# EAGLE design WiFi_MBUS_Reader (EAGLE 6.6.0)
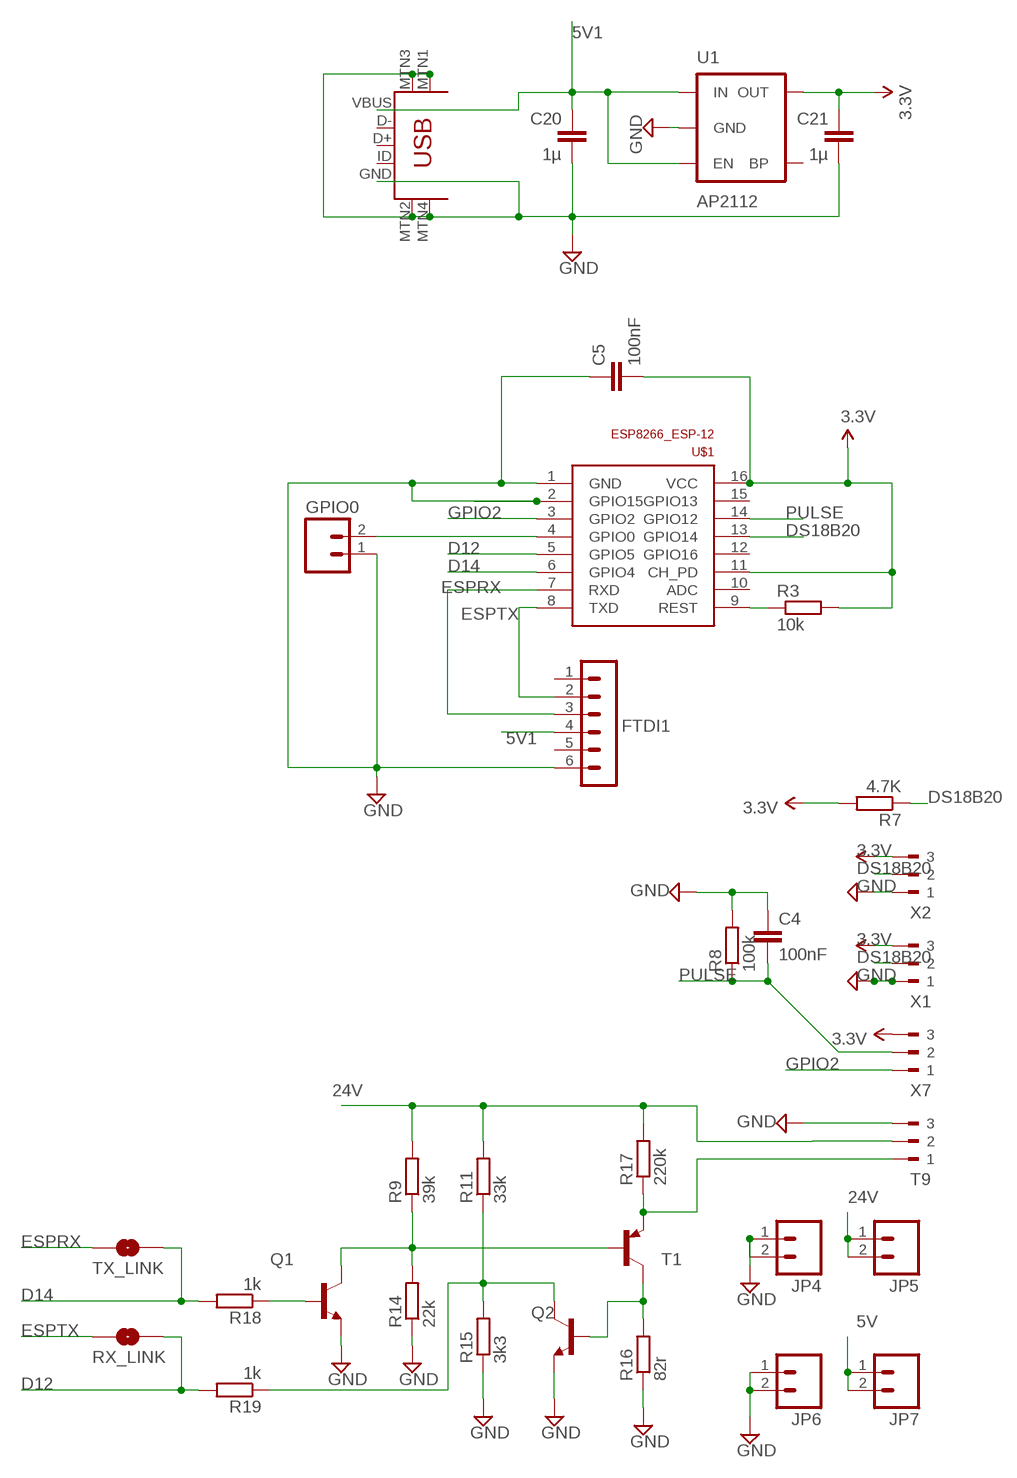
[diagram p0: schematic, sheet 1]

## Parts
C4  100nF  C-EUC0603  [C0603]
C5  100nF  C-EUC0603  [C0603]
C20  1µ  C-EUC0603  [C0603]
C21  1µ  C-EUC0603  [C0603]
FTDI1  FTDI  MA06-1  [MA06-1]
GPIO0  M02PTH  [1X02]
JP4  M02PTH  [1X02]
JP5  M02PTH  [1X02]
JP6  M02PTH  [1X02]
JP7  M02PTH  [1X02]
Q1  BC808-NPN-SOT23-BEC  [SOT23-BEC]
Q2  BC808-NPN-SOT23-BEC  [SOT23-BEC]
R3  10k  R-EU_R0603  [R0603]
R7  4.7K  R-EU_R0603  [R0603]
R8  100k  R-EU_R0603  [R0603]
R9  39k  R-EU_R0603  [R0603]
R11  33k  R-EU_R0603  [R0603]
R14  22k  R-EU_R0603  [R0603]
R15  3k3  R-EU_R0603  [R0603]
R16  82r  R-EU_R0603  [R0603]
R17  220k  R-EU_R0603  [R0603]
R18  1k  R-EU_R0603  [R0603]
R19  1k  R-EU_R0603  [R0603]
RX_LINK  SOLDERJUMPERNO  [SJ_2S-NO]
T1  BC807-16-PNP-SOT23-BEC  [SOT23-BEC]
T9  180-3  [180-3]
TX_LINK  SOLDERJUMPERNO  [SJ_2S-NO]
U1  AP2112  V_REG_LDOSMD  [SOT23-5]
U$1  ESP8266_ESP-12  [ESP8266-ESP12]
U$10  USB-MINIB-5PIN  [USB-MINIB-CISECO]
X1  180-3  [180-3]
X2  180-3  [180-3]
X7  180-3  [180-3]

## Nets
3.3V: C5.2 C21.1 R3.2 R7.2 U1.5(OUT) U$1.11(CH_PD) U$1.16(VCC) X1.3 X2.3 X7.3
5V [power]: JP7.1 JP7.2
5V1 [power]: C20.1 FTDI1.4 U1.1(IN) U1.3(EN) U$10.VBUS
24V: JP5.1 JP5.2 R9.2 R11.2 R17.2 T9.2
D12: R19.2 RX_LINK.2 U$1.5(GPIO5)
D14: R18.2 TX_LINK.2 U$1.6(GPIO4)
DS18B20: R7.1 U$1.13(GPIO14) X1.2 X2.2
ESPRX: FTDI1.3 TX_LINK.1 U$1.7(RXD)
ESPTX: FTDI1.2 RX_LINK.1 U$1.8(TXD)
GND [power]: C4.1 C5.1 C20.2 C21.2 FTDI1.6 GPIO0.1 JP4.1 JP4.2 JP6.1 JP6.2 Q1.E Q2.E R8.2 R14.1 R15.1 R16.1 T9.3 U1.2(GND) U$1.1(GND) U$1.2(GPIO15) U$10.GND U$10.MTN1(MTN2) U$10.MTN2(MTN3) U$10.MTN3(MTN1) U$10.MTN4 X1.1 X2.1
GPIO2: U$1.3(GPIO2) X7.1
N$13: R17.1 T1.E T9.1
N$16: Q2.B R16.2 T1.C
N$18: Q1.C R9.1 R14.2 T1.B
N$21: Q2.C R11.1 R15.2 R19.1
N$25: Q1.B R18.1
N$29: GPIO0.2 U$1.4(GPIO0)
N$40: R3.1 U$1.9(REST)
PULSE: C4.2 R8.1 U$1.14(GPIO12) X7.2
Unconnected: FTDI1.1 FTDI1.5 U1.4(BP) U$1.10(ADC) U$1.12(GPIO16) U$1.15(GPIO13) U$10.D+ U$10.D- U$10.ID

## Library data of the parts
C4 C5 C20 C21 = resistor:C-EU: CAPACITOR, European symbol
FTDI1 = JeeLabs:MA06-1: PIN HEADER
GPIO0 JP4-JP7 = SparkFun:M02: Header 2 Standard 2-pin 0.1" header. Use with straight break away headers (SKU : PRT-00116), right angle break away headers (PRT-00553), swiss pins (PRT-00743), machine pins (PRT-00117), and female headers (PRT-00115). Molex polarized connector foot print use with SKU : PRT-08233 with associated crimp pins and housings.
Q1 Q2 = transistor:*-NPN-: NPN Transistror BF959 corrected 2008.03.06
R3 R7-R9 R11 R14-R19 = rcl:R-EU_: RESISTOR, European symbol
RX_LINK TX_LINK = SparkFun:SOLDERJUMPER: Solder Jumper Standard SMD solder jumper. Used to automate production. Two varients : Normally Open and Normally Closed are the same, but have different paste layers. NC will have a large amount of paste and should jumper during reflow.
T1 = transistor:*-PNP-: PNP Transistror
T9 X1 X2 X7 = con-weidmueller-sl35:180-3: WEIDMUELLER CLAMP CONNECTOR; OC_FARNELL: unknown; OC_NEWARK: unknown
U1 = SparkFun:V_REG_LDO: Voltage Regulator LDO Standard 150mA LDO voltage regulator in SOT-23 layout. Micrel part MIC5205. BP (by-pass) pin is used to lower output noise with 470pF cap.
U$1 = ESP8266-ESP12:ESP8266_ESP-12
U$10 = Ciseco USB miniB_Updated:USB-MINIB: Mini-USB "B" connector with 5th pin broken out. Created new symbol breaking out 5th "ID" pin in mini/micro USB connector spec. See: http://en.wikipedia.org/wiki/Mini_usb#Cables. Uses same footprint as 4-pin symbol. Also added pins to connect to mounting / shield pads if required (probably not generally needed as signals aren't shielded once they leave the connector). Modified by Ciseco for Rapid Part 24-0357

## Net classes
0 default: width 0.203 mm, drill 0.6 mm, clearance 0.203 mm
1 power: width 0.381 mm, drill 0.6 mm, clearance 0.254 mm
2 gnd: width 0.254 mm, drill 0.6 mm, clearance 0.254 mm

## Board
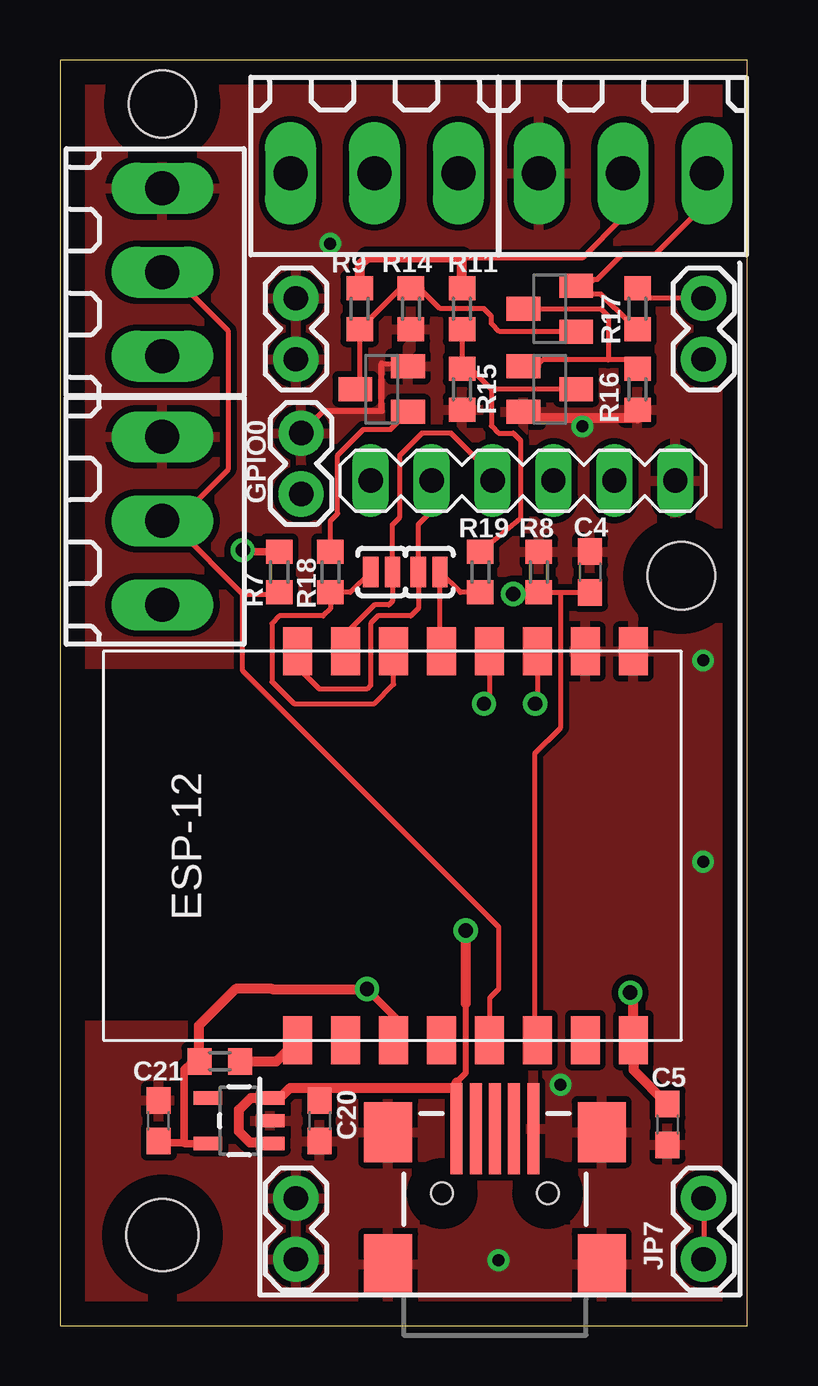
[diagram p1: board, top side]
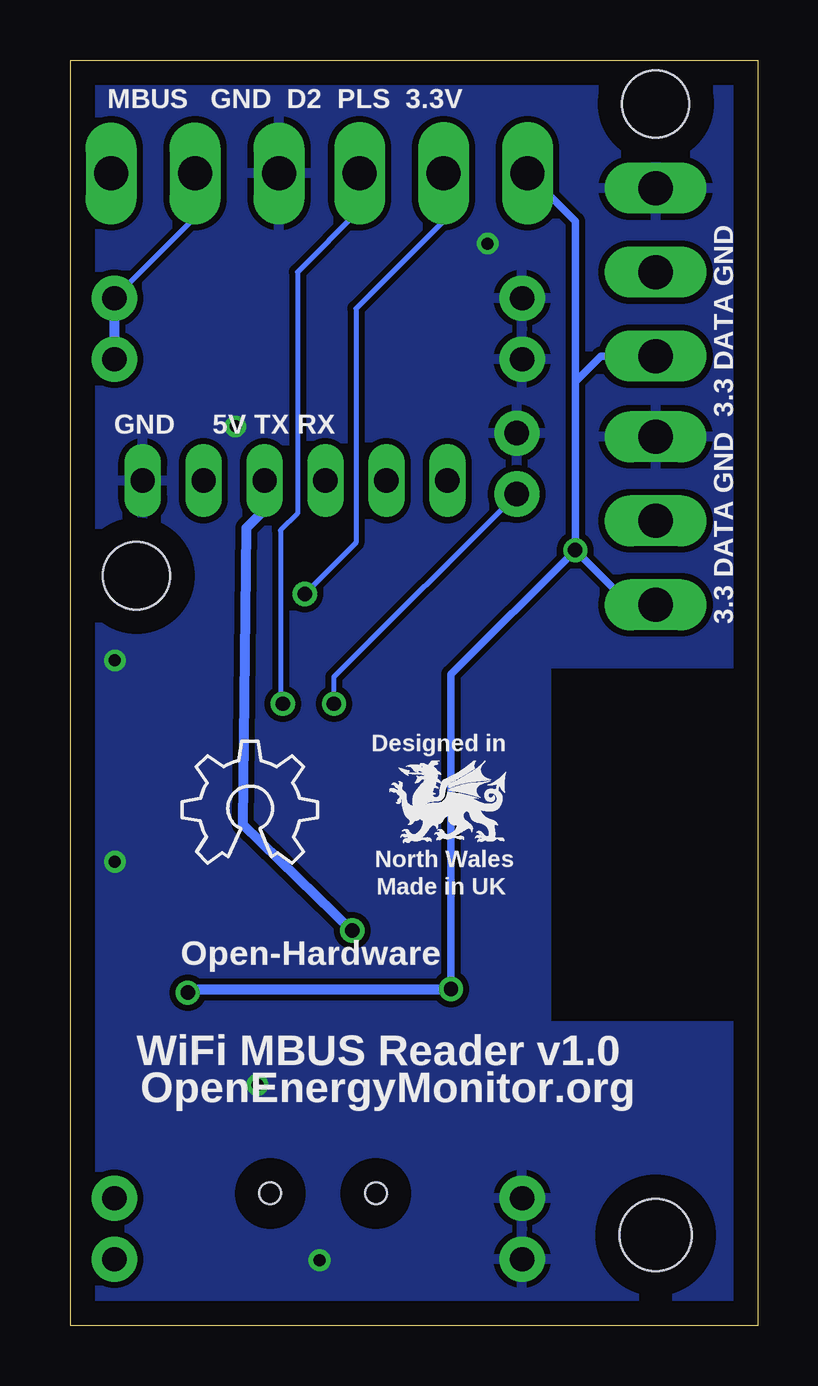
[diagram p2: board, bottom side, seen from below]

Size 28.65 x 52.73 mm. Coordinates in mm from the lower left corner, seen from the top.
Outline: 28.65,0 28.65,52.73 0,52.73 0,0 28.65,0
Copper layers (1*16): Top 0.035mm / dielectric 1.5mm / Bottom 0.035mm
Design rules "default *": minimum track width 8mil, minimum drill 24mil, track to track 8mil, track to pad 8mil, pad to pad 8mil, via to via 8mil, smd to smd 8mil, copper to edge 40mil, drill to drill 8mil, minimum pad ring 10mil, minimum via ring 8mil, stop-mask expansion 0.075mm, vias tented up to drill 0.6mm, thermal gap 10mil
Holes 2.8 mm at 4.27,50.9 25.91,31.24
Holes 3 mm at 4.27,3.77

### Footprints (pad centres in the part's own frame; a part is rotated, then mirrored left to right if it is on the bottom)
C0603 = smd 1.1 x 1: 1 -0.85,0; 2 0.85,0
MA06-1 = drill 1.016 long: 1 0,0; 2 2.54,0; 3 5.08,0; 4 7.62,0; 5 10.16,0; 6 12.7,0
1X02 = drill 1.016 pad 1.88: 1 0,0; 2 2.54,0
SOT23-BEC = smd 1 x 1.4: B -0.95,-1.1; C 0,1.1; E 0.95,-1.1
R0603 = smd 1 x 1.1: 1 -0.85,0; 2 0.85,0
SJ_2S-NO = smd 0.635 x 1.27: 1 -0.45,0; 2 0.45,0
180-3 = drill 1.422 long: 1 -3.5,0; 2 0,0; 3 3.5,0
SOT23-5 = smd 0.55 x 1.2: 1 -0.95,-1.3; 2 0,-1.3; 3 0.95,-1.3; 4 0.95,1.3; 5 -0.95,1.3
ESP8266-ESP12 = smd 2 x 1.2: 1 16.2,2; 2 16.2,4; 3 16.2,6; 4 16.2,8; 5 16.2,10; 6 16.2,12; 7 16.2,14; 8 16.2,16; 9 0,16; 10 0,14; 11 0,12; 12 0,10; 13 0,8; 14 0,6; 15 0,4; 16 0,2
USB-MINIB-CISECO = smd 3.8 x 0.5: D+ 7.9,0; D- 7.9,0.8; GND 7.9,-1.6; ID 7.9,-0.8; VBUS 7.9,1.6 | smd 2.5 x 2: MTN1 2.25,4.45; MTN2 7.75,4.45; MTN3 2.25,-4.45; MTN4 7.75,-4.45 | hole 0.9: 5.2,2.2; 5.2,-2.2

### Placement (x,y rotation side)
C4  22.1,31.39 270 top
C5  25.33,8.38 90 top
C20  10.82,8.53 270 top
C21  4.11,8.53 90 top
FTDI1  12.95,35.2 0 top
GPIO0  10.06,37.19 270 top
JP4  9.83,40.26 90 top
JP5  26.83,40.26 90 top
JP6  9.83,2.76 90 top
JP7  26.83,2.76 90 top
LOGO1  OSHW_LOGO_6MILX0200-NT  [OSHW_6X200_NOTEXT]  24.02,19.26 0 bottom
Q1  13.41,39.01 90 top
Q2  20.42,39.01 270 top
R3  6.67,11.01 180 top
R7  9.14,31.39 90 top
R8  19.96,31.39 90 top
R9  12.5,42.37 90 top
R11  16.76,42.37 90 top
R14  14.63,42.37 90 top
R15  16.76,39.01 90 top
R16  24.08,39.01 90 top
R17  24.08,42.37 90 top
R18  11.28,31.39 270 top
R19  17.53,31.39 270 top
RX_LINK  15.39,31.39 0 top
T1  20.42,42.37 90 top
T9  23.47,48.01 180 top
TX_LINK  13.41,31.39 180 top
U1  7.47,8.53 90 top
U$1  25.91,11.89 90 top
U$10  18.14,0.3 90 top
X1  4.27,43.89 270 top
X2  4.27,33.53 270 top
X7  13.11,48.01 180 top

### Tracks (layer width: path | path; a pad name or v marks a point on that pad's centre or on a via)
3.3V  (via drill 0.6)
  Top 0.203: 7.68,32.24 v7.62,32.31 | 8.84,14.03 8.85,14.02
  Top 0.305: R3.2 5.78,10.97 5.49,10.97 5.18,10.67 5.18,7.62 | 5.18,7.62 5.22,7.58 U1.5 | C21.1 4.18,7.62 5.18,7.62 | X2.3 4.27,30.18 | 12.79,14.03 v12.8,14.02 14.02,12.8 14.02,12 U$1.11 | R7.2 7.68,32.24
  Top 0.406: C5.2 23.91,10.65 U$1.16 23.91,13.73 v23.77,13.87 | 8.85,14.02 v12.8,14.02 | 8.84,14.03 7.33,14.03 5.79,12.5 5.79,11.03 R3.2
  Bottom 0.203: 5.34,30.03 X2.3 5.02,30.03 | v12.8,14.02 12.79,14.03
  Bottom 0.305: X7.3 7.62,46.02 7.62,39.32 | 7.62,39.32 v7.62,32.31 | v7.62,32.31 5.34,30.03 | X1.3 6.55,40.39 7.62,39.32 | v12.8,14.02 12.8,27.13 v7.62,32.31
  Bottom 0.406: v23.77,13.87 23.62,14.02 v12.8,14.02
5V
  Top 0.203: JP7.2 JP7.1
5V1  (via drill 0.6)
  Top 0.203: U1.1 8.73,7.62 | U$10.VBUS 16.54,9.91 | U1.3 9.18,9.48 | C20.1 10.82,9.75 10.67,9.91
  Top 0.254: 16.92,13.41 16.92,10.52 16.54,10.13
  Top 0.406: 8.73,7.62 7.92,7.62 7.47,8.08 7.47,8.99 7.96,9.48 U1.3 | 9.18,9.48 9.6,9.91 10.67,9.91 16.54,9.91 16.54,10.13 | v16.92,16.46 16.92,13.41
  Bottom 0.203: FTDI1.4 20.57,33.98
  Bottom 0.406: 20.57,33.98 21.34,33.22 21.49,20.88 v16.92,16.46
24V
  Top 0.203: JP5.2 24.49,42.8 R17.2 | 16.76,44.5 21.8,44.5 23.47,46.17 T9.2
  Top 0.406: R11.2 16.76,44.5 12.8,44.5 12.5,44.2 R9.2
  Bottom 0.203: T9.2 23.47,46.17 JP5.2
  Bottom 0.406: JP5.2 JP5.1
D12
  Top 0.203: R19.2 16.69,30.54 RX_LINK.2 15.84,28.15 U$1.5
D14
  Top 0.203: TX_LINK.2 12.11,30.54 11.34,30.54 | 11.34,30.54 R18.2 | 11.34,30.54 11.28,30.48 11.28,29.87 10.97,29.57 9.14,29.57 8.84,29.26 8.84,26.82 9.75,25.91 13.11,25.91 13.91,26.71 U$1.6
DS18B20
  Top 0.203: X2.2 4.88,33.53 | 5.18,43.89 X1.2 4.57,43.89 7.01,41.45 7.01,35.66 4.88,33.53 | 4.88,33.53 4.88,33.22 7.62,30.48 | 7.62,30.48 9.08,30.48 R7.1 9.38,30.54 | 7.62,30.48 7.62,27.28 18.29,16.61 18.29,14.02 17.91,13.64 U$1.13
ESPRX
  Top 0.203: 11.91,28.37 U$1.7 12.04,28.22 12.04,28.96 13.11,30.02 13.72,30.02 13.86,30.17 TX_LINK.1 13.86,33.37 14.17,33.68 14.17,36.27 15.09,37.19 16.31,37.19 18.03,35.46 FTDI1.3
ESPTX
  Top 0.203: U$1.8 9.91,27.43 10.82,26.52 12.8,26.52 12.95,26.67 12.95,29.26 13.26,29.57 14.63,29.57 14.94,29.88 RX_LINK.1 14.94,33.38 15.49,33.93 FTDI1.2
GND  (via drill 0.5)
  Top 0.203: 13.41,40.08 14.39,40.08 Q1.E | 10.97,38.1 GPIO0.1
  Top 0.254: 13.41,40.08 13.41,38.1 10.97,38.1
  Top 0.406: 19.59,37.8 Q2.E 19.81,38.06 19.81,37.8 24.08,37.8 R16.1
  other vias: 26.81,27.71 26.81,19.33 20.87,10.03 18.28,2.72 11.27,45.08 21.79,37.46
  pour Bottom (isolate 0.254): 0,0 28.65,0 28.65,52.73 0,52.73 0,27.58 8.84,27.58 8.84,12.5 0,12.5
  pour Top (isolate 0.254): 0,0 28.65,0 28.65,52.73 0,52.73 0,27.58 8.84,27.58 8.84,12.5 0,12.5
GPIO2  (via drill 0.6)
  Top 0.203: U$1.3 19.91,26 v19.81,25.91
  Bottom 0.203: X7.1 16.61,46.48 19.2,43.89 19.2,33.83 19.91,33.13 19.91,26 v19.81,25.91
N$13
  Top 0.203: T9.1 arc90 26.82,47.86 26.82,46.63 24.84,44.65 23.47,44.65 22.4,43.59 22.25,43.59 21.95,43.28 21.56,43.28 | 23.77,41.76 22.55,42.98 21.86,42.98 T1.E
  Top 0.406: R17.1 24.02,41.45 23.77,41.45 23.77,41.76 | 21.91,43.32 T1.E 21.56,43.28
N$16
  Top 0.203: 19.85,39.96 20.12,40.23 22.86,40.23 | R16.2 23.71,40.23 22.86,40.23 | 19.38,42.37 22.55,42.37 22.86,42.06 22.86,40.23
  Top 0.406: T1.C 19.35,42.34 19.38,42.37 | Q2.B 19.85,39.96
N$18
  Top 0.203: T1.B 18.32,41.42 17.98,41.76 17.98,42.06 17.68,42.37 15.85,42.37 15,43.22 | R14.2 14.2,43.22 R9.1 | 12.5,41.45 12.5,39.2 Q1.C
  Top 0.406: 15,43.22 R14.2 | R9.1 12.5,41.45
N$21
  Top 0.203: Q2.C 17.98,39.01 | 17.98,39.01 17.13,39.86 R15.2 R11.1 | 17.98,39.01 17.98,37.49 18.29,37.19 18.9,37.19 19.2,36.88 19.2,33.62 R19.1
N$25
  Top 0.203: R18.1 11.28,33.53 11.58,33.83 11.58,36.27 12.65,37.34 13.79,37.34 Q1.B 14.09,37.64
N$29  (via drill 0.6)
  Top 0.203: 17.98,28.04 17.94,28.09 U$1.4 17.91,26.14 v17.68,25.91
  Bottom 0.203: v17.68,25.91 17.68,27.03 GPIO0.2
N$40
  Top 0.406: R3.1 9.03,11.01 U$1.9
PULSE  (via drill 0.6)
  Top 0.203: v18.9,30.48 18.96,30.54 R8.1 20.95,30.54 | 20.95,30.54 C4.2 | U$1.14 19.81,11.98 19.81,23.85 20.88,24.92 20.88,30.47 20.95,30.54
  Bottom 0.203: X7.2 13.11,46.02 16.76,42.37 16.76,32.61 v18.9,30.48

### Text on the board
_bsilk: MBUS GND D2 PLS 3.3V | GND 5V TX RX | 3.3 DATA GND 3.3 DATA GND | Designed in | North Wales | Made in UK | Open-Hardware | WiFi MBUS Reader v1.0 | OpenEnergyMonitor.org